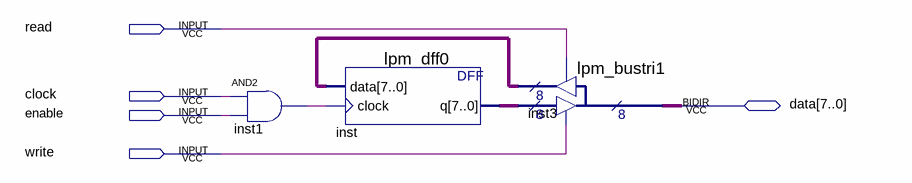
[diagram p0: schematic sheet]
// Quartus schematic Buffer.bdf as structural Verilog: 3 symbols, 5 pins
module Buffer (
  input  read,
  input  clock,
  input  enable,
  input  write,
  inout  [7:0] data
);

  wire inst1_out;
  wire [7:0] inst3_result, inst_q;

  and inst1 (inst1_out, clock, enable);
  lpm_dff0 inst (.data(inst3_result), .clock(inst1_out), .q(inst_q));
  lpm_bustri1 inst3 (.enabledt(write), .data(inst_q), .enabletr(read), .result(inst3_result), .tridata(data));
endmodule
